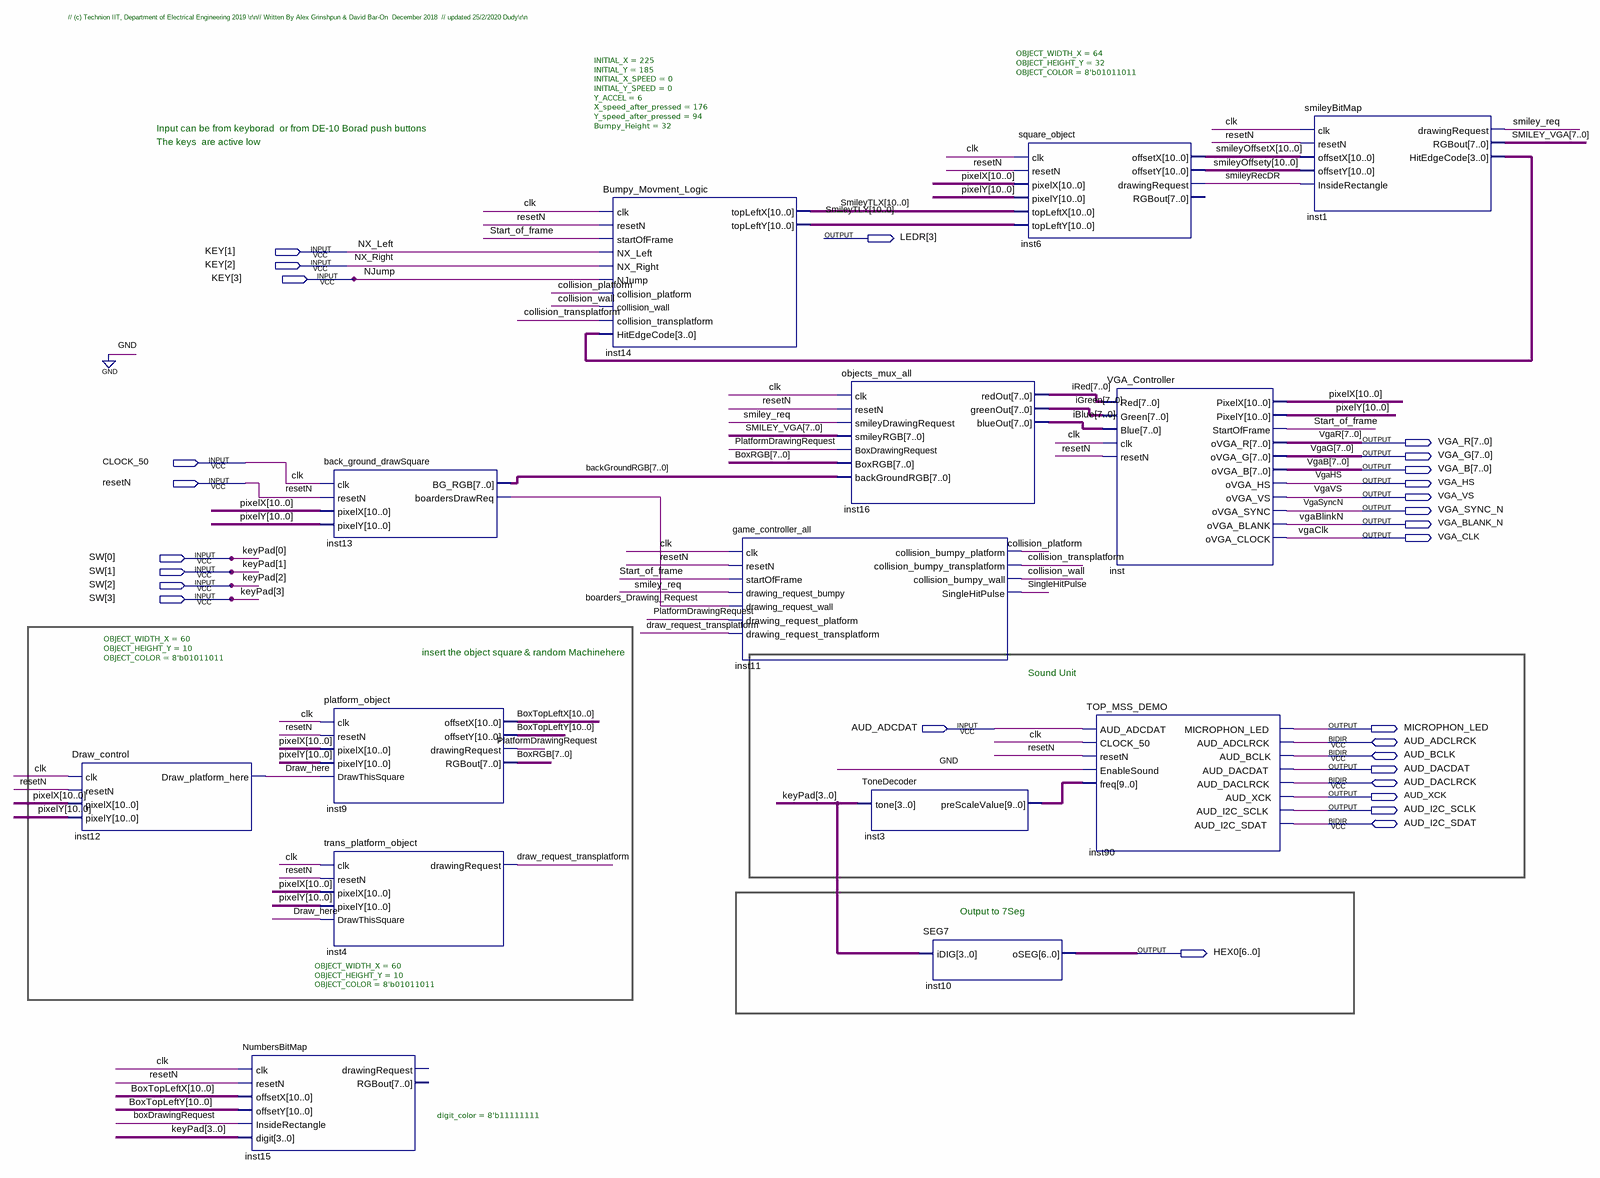
[diagram p0: schematic sheet]
// Quartus schematic Top_bumpy_Game.bdf as structural Verilog: 14 symbols, 28 pins
module Top_bumpy_Game (
  input  [3:1] KEY,
  input  CLOCK_50,
  input  resetN,
  input  [3:0] SW,
  input  AUD_ADCDAT,
  inout  AUD_ADCLRCK,
  inout  AUD_BCLK,
  inout  AUD_DACLRCK,
  inout  AUD_I2C_SDAT,
  output [3:3] LEDR,
  output [7:0] VGA_R,
  output [7:0] VGA_G,
  output [7:0] VGA_B,
  output VGA_HS,
  output VGA_VS,
  output VGA_SYNC_N,
  output VGA_BLANK_N,
  output VGA_CLK,
  output MICROPHON_LED,
  output AUD_DACDAT,
  output AUD_XCK,
  output AUD_I2C_SCLK,
  output [6:0] HEX0
);

  wire boarders_Drawing_Request, boxDrawingRequest, collision_platform, collision_transplatform,
       collision_wall, Draw_here, draw_request_transplatform, PlatformDrawingRequest, SingleHitPulse,
       smiley_req, smileyRecDR, Start_of_frame;
  wire [3:0] inst1_hitedgecode;
  wire [7:0] backGroundRGB, BoxRGB, iBlue, iGreen, iRed, SMILEY_VGA;
  wire [9:0] inst3_prescalevalue;
  wire [10:0] BoxTopLeftX, BoxTopLeftY, pixelX, pixelY, smileyOffsetX, smileyOffsety, SmileyTLX, SmileyTLY;

  Draw_control inst12 (
    .clk(CLOCK_50), .resetN(resetN), .pixelX(pixelX), .pixelY(pixelY), .Draw_platform_here(Draw_here));
  NumbersBitMap #(.digit_color(8'b11111111)) inst15 (
    .clk(CLOCK_50), .resetN(resetN), .offsetX(BoxTopLeftX), .offsetY(BoxTopLeftY),
    .InsideRectangle(boxDrawingRequest), .digit(SW));  // open: drawingRequest, RGBout
  back_ground_drawSquare inst13 (
    .clk(CLOCK_50), .resetN(resetN), .pixelX(pixelX), .pixelY(pixelY), .BG_RGB(backGroundRGB),
    .boardersDrawReq(boarders_Drawing_Request));
  platform_object #(.OBJECT_WIDTH_X(60), .OBJECT_HEIGHT_Y(10), .OBJECT_COLOR(8'b01011011)) inst9 (
    .clk(CLOCK_50), .resetN(resetN), .pixelX(pixelX), .pixelY(pixelY), .DrawThisSquare(Draw_here),
    .offsetX(BoxTopLeftX), .offsetY(BoxTopLeftY), .drawingRequest(PlatformDrawingRequest), .RGBout(BoxRGB));
  trans_platform_object #(.OBJECT_WIDTH_X(60), .OBJECT_HEIGHT_Y(10), .OBJECT_COLOR(8'b01011011)) inst4 (
    .clk(CLOCK_50), .resetN(resetN), .pixelX(pixelX), .pixelY(pixelY), .DrawThisSquare(Draw_here),
    .drawingRequest(draw_request_transplatform));
  Bumpy_Movment_Logic #(.INITIAL_X(225), .INITIAL_Y(185), .INITIAL_X_SPEED(0), .INITIAL_Y_SPEED(0), .Y_ACCEL(6), .X_speed_after_pressed(176), .Y_speed_after_pressed(94), .Bumpy_Height(32)) inst14 (
    .clk(CLOCK_50), .resetN(resetN), .startOfFrame(Start_of_frame), .NX_Left(KEY[1]), .NX_Right(KEY[2]),
    .NJump(KEY[3]), .collision_platform(collision_platform), .collision_wall(collision_wall),
    .collision_transplatform(collision_transplatform), .HitEdgeCode(inst1_hitedgecode), .topLeftX(SmileyTLX),
    .topLeftY(SmileyTLY));
  game_controller_all inst11 (
    .clk(CLOCK_50), .resetN(resetN), .startOfFrame(Start_of_frame), .drawing_request_bumpy(smiley_req),
    .drawing_request_wall(boarders_Drawing_Request), .drawing_request_platform(PlatformDrawingRequest),
    .drawing_request_transplatform(draw_request_transplatform),
    .collision_bumpy_platform(collision_platform), .collision_bumpy_transplatform(collision_transplatform),
    .collision_bumpy_wall(collision_wall), .SingleHitPulse(SingleHitPulse));
  objects_mux_all inst16 (
    .clk(CLOCK_50), .resetN(resetN), .smileyDrawingRequest(smiley_req), .smileyRGB(SMILEY_VGA),
    .BoxDrawingRequest(PlatformDrawingRequest), .BoxRGB(BoxRGB), .backGroundRGB(backGroundRGB),
    .redOut(iRed), .greenOut(iGreen), .blueOut(iBlue));
  ToneDecoder inst3 (.tone(SW), .preScaleValue(inst3_prescalevalue));
  SEG7 inst10 (.iDIG(SW), .oSEG(HEX0));
  square_object #(.OBJECT_WIDTH_X(64), .OBJECT_HEIGHT_Y(32), .OBJECT_COLOR(8'b01011011)) inst6 (
    .clk(CLOCK_50), .resetN(resetN), .pixelX(pixelX), .pixelY(pixelY), .topLeftX(SmileyTLX),
    .topLeftY(SmileyTLY), .offsetX(smileyOffsetX), .offsetY(smileyOffsety), .drawingRequest(smileyRecDR));  // open: RGBout
  VGA_Controller inst (
    .Red(iRed), .Green(iGreen), .Blue(iBlue), .clk(CLOCK_50), .resetN(resetN), .PixelX(pixelX),
    .PixelY(pixelY), .StartOfFrame(Start_of_frame), .oVGA_R(VGA_R), .oVGA_G(VGA_G), .oVGA_B(VGA_B),
    .oVGA_HS(VGA_HS), .oVGA_VS(VGA_VS), .oVGA_SYNC(VGA_SYNC_N), .oVGA_BLANK(VGA_BLANK_N), .oVGA_CLOCK(VGA_CLK));
  TOP_MSS_DEMO inst90 (
    .AUD_ADCDAT(AUD_ADCDAT), .CLOCK_50(CLOCK_50), .resetN(resetN), .EnableSound(1'b0),
    .freq(inst3_prescalevalue), .MICROPHON_LED(MICROPHON_LED), .AUD_DACDAT(AUD_DACDAT), .AUD_XCK(AUD_XCK),
    .AUD_I2C_SCLK(AUD_I2C_SCLK), .AUD_ADCLRCK(AUD_ADCLRCK), .AUD_BCLK(AUD_BCLK), .AUD_DACLRCK(AUD_DACLRCK),
    .AUD_I2C_SDAT(AUD_I2C_SDAT));
  smileyBitMap inst1 (
    .clk(CLOCK_50), .resetN(resetN), .offsetX(smileyOffsetX), .offsetY(smileyOffsety),
    .InsideRectangle(smileyRecDR), .drawingRequest(smiley_req), .RGBout(SMILEY_VGA),
    .HitEdgeCode(inst1_hitedgecode));

  // Other names for the same wires on the sheet: clk = CLOCK_50; NJump = KEY[3]; NX_Left = KEY[1]; NX_Right = KEY[2];
  //   keyPad[3:0] = SW; VgaB[7:0] = VGA_B; vgaBlinkN = VGA_BLANK_N; vgaClk = VGA_CLK; VgaG[7:0] = VGA_G;
  //   VgaHS = VGA_HS; VgaR[7:0] = VGA_R; VgaSyncN = VGA_SYNC_N; VgaVS = VGA_VS

  // Notes on the sheet:
  //   // (c) Technion IIT, Department of Electrical Engineering 2019 \r\n// Written By Alex Grinshpun & David Bar-On  December 2018  // updated 25/2/2020 Dudy\r\n
  //   Input can be from keyborad  or from DE-10 Borad push buttons  
  //   The keys  are active low
  //   insert the object square
  //   & random Machine
  //   here
  //   Sound Unit
  //   Output to 7Seg
endmodule
